# EAGLE design Sparki_Mainboard (EAGLE 6.3)

## Sheet 1 of 2
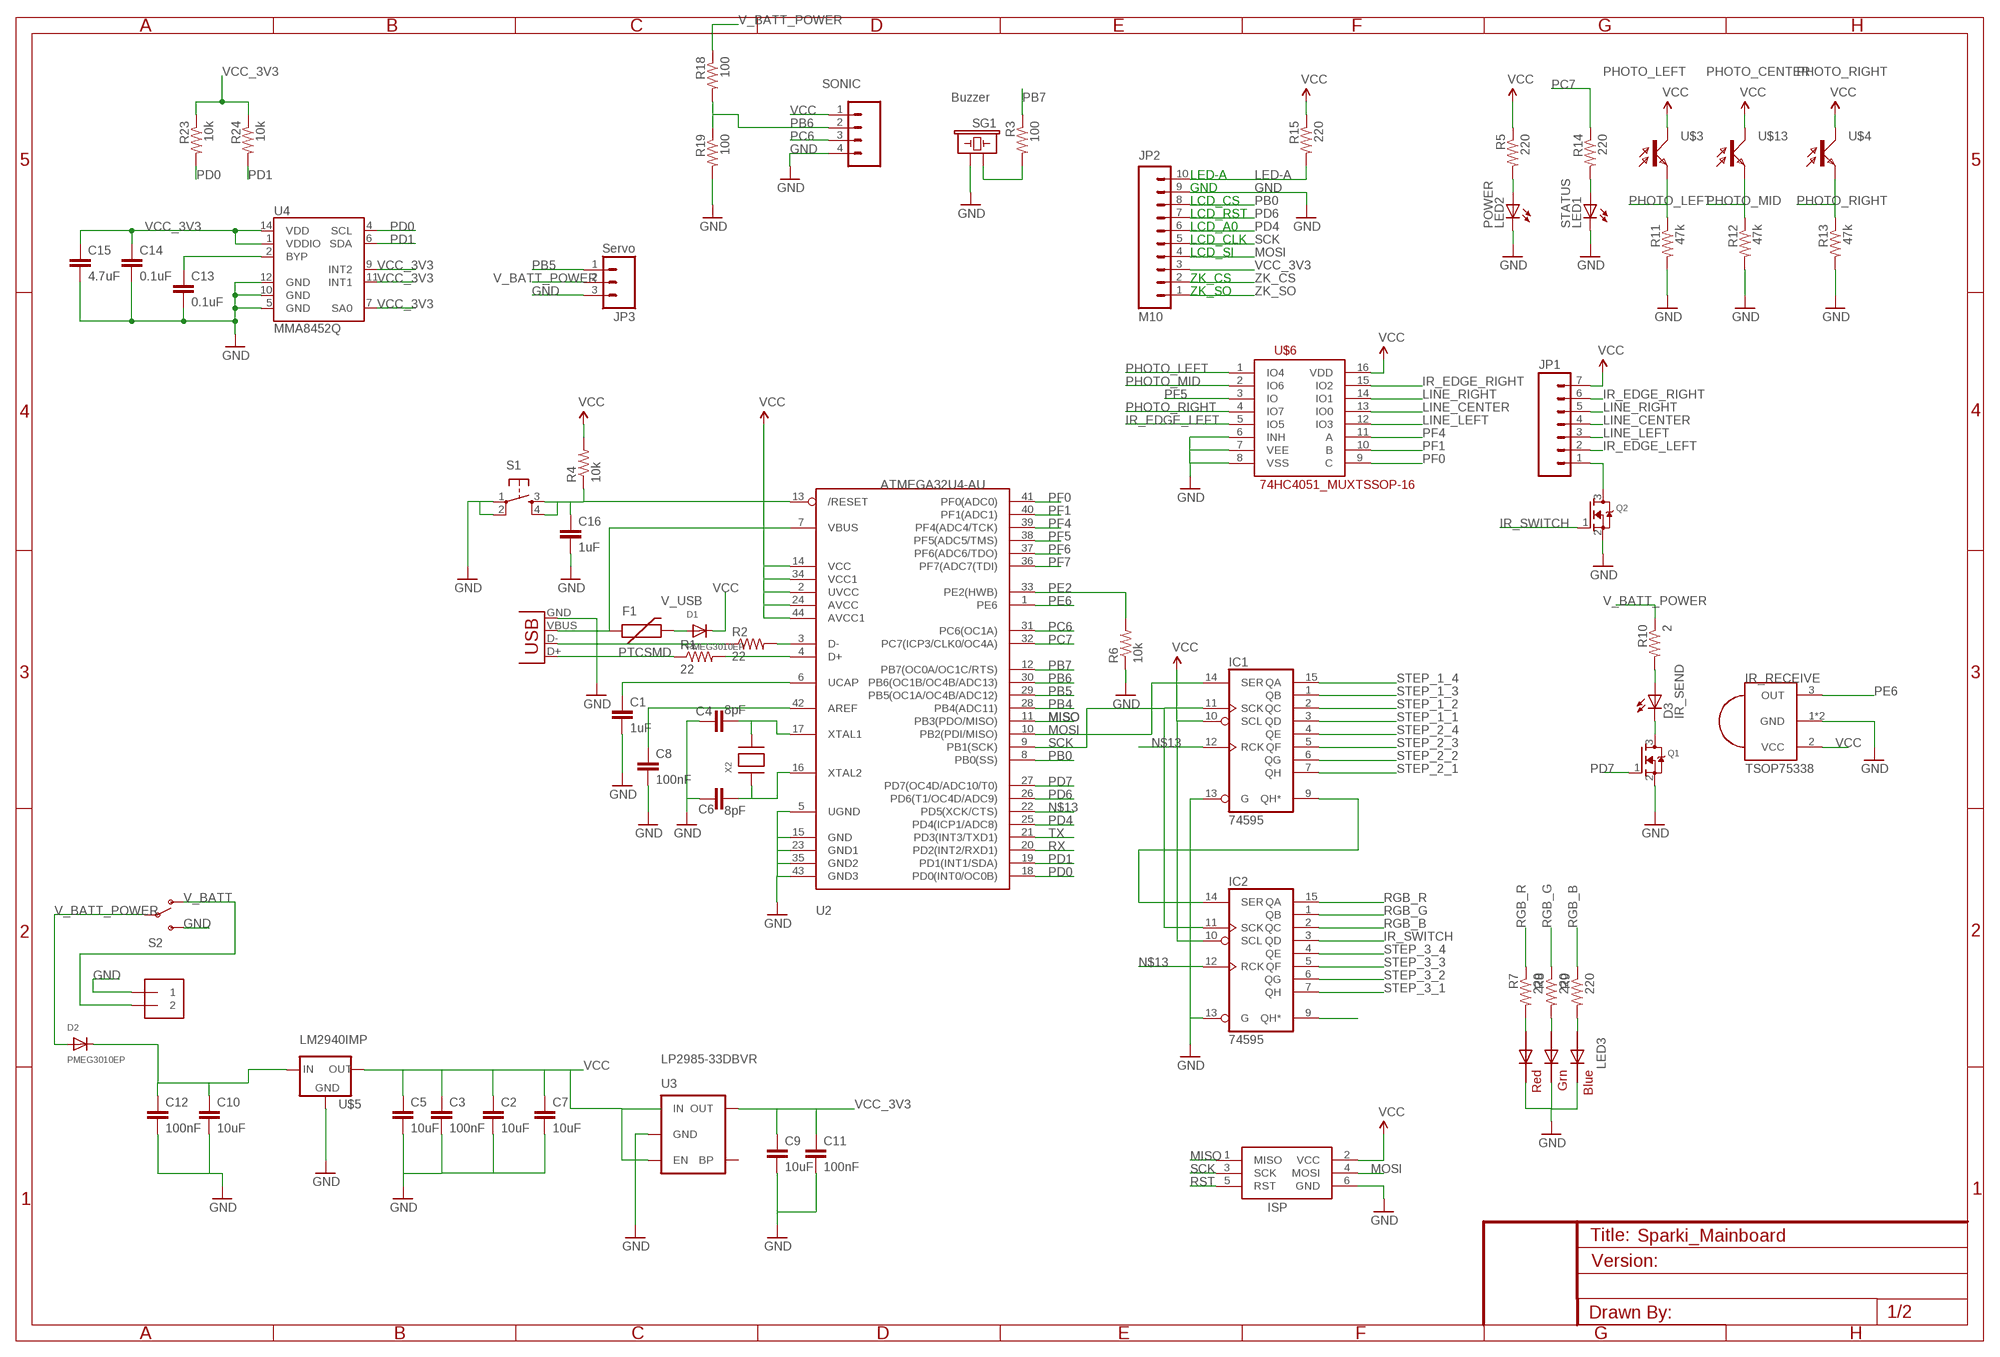
[diagram p0: schematic, sheet 1, part 1 of 2]
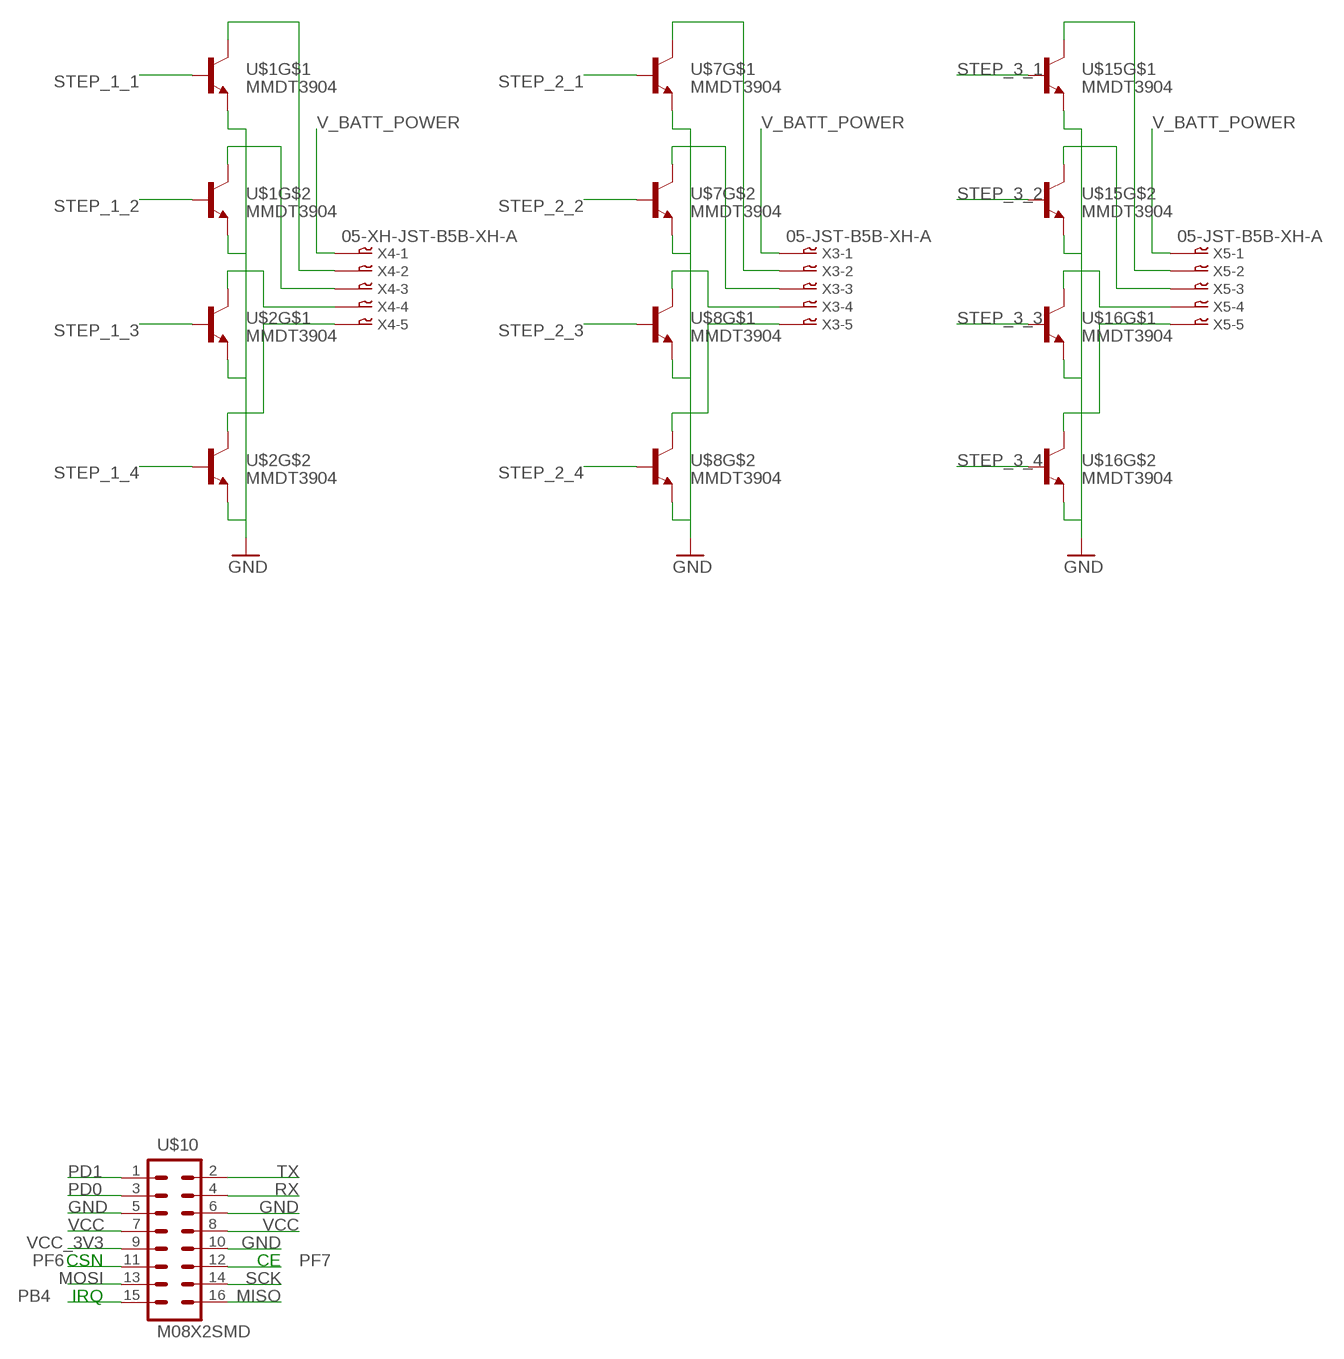
[diagram p1: schematic, sheet 1, part 2 of 2]

### Parts
C1  1uF  CAP0603-CAP  [0603-CAP]
C2  10uF  CAP0805  [0805]
C3  100nF  CAP0603-CAP  [0603-CAP]
C4  8pF  CAP0603-CAP  [0603-CAP]
C5  10uF  CAP0805  [0805]
C6  8pF  CAP0603-CAP  [0603-CAP]
C7  10uF  CAP0805  [0805]
C8  100nF  CAP0603-CAP  [0603-CAP]
C9  10uF  CAP0805  [0805]
C10  10uF  CAP0805  [0805]
C11  100nF  CAP0603-CAP  [0603-CAP]
C12  100nF  CAP0603-CAP  [0603-CAP]
C13  0.1uF  CAP0603-CAP  [0603-CAP]
C14  0.1uF  CAP0603-CAP  [0603-CAP]
C15  4.7uF  CAP0805  [0805]
C16  1uF  CAP0603-CAP  [0603-CAP]
D1  PMEG3010EP  [SOD-128]
D2  PMEG3010EP  [SOD-128]
D3  IR_SEND  LED-FKIT-1206  [FKIT-LED-1206]
F1  PTCSMD  [PTC-1206]
IC1  74595  [TSSOP16]
IC2  74595  [TSSOP16]
IR_RECEIVE  TSOP75338  [TSOP75338]
ISP  AVRISP-6  [AVRISP]
J1  1X2-3.5MM  [1X2-3.5MM]
JP1  M07  [1X07]
JP2  M10  [1X10-2.54MM-SMD]
JP3  Servo  M03PTH  [1X03]
LED1  STATUS  LEDSML0805  [SML0805]
LED2  POWER  LEDSML0805  [SML0805]
LED3  RGB LED  RGBLED5050  [RGBLED5050]
Q1  MOSFET-NREFLOW  [SOT23]
Q2  MOSFET-NREFLOW  [SOT23]
R1  22  RESISTOR0603-RES  [0603-RES]
R2  22  RESISTOR0603-RES  [0603-RES]
R3  100  RESISTOR0603-RES  [0603-RES]
R4  10k  RESISTOR0603-RES  [0603-RES]
R5  220  RESISTOR0603-RES  [0603-RES]
R6  10k  RESISTOR0603-RES  [0603-RES]
R7  220  RESISTOR0603-RES  [0603-RES]
R8  220  RESISTOR0603-RES  [0603-RES]
R9  220  RESISTOR0603-RES  [0603-RES]
R10  2  RESISTOR0603-RES  [0603-RES]
R11  47k  RESISTOR0603-RES  [0603-RES]
R12  47k  RESISTOR0603-RES  [0603-RES]
R13  47k  RESISTOR0603-RES  [0603-RES]
R14  220  RESISTOR0603-RES  [0603-RES]
R15  220  RESISTOR0603-RES  [0603-RES]
R18  100  RESISTOR0603-RES  [0603-RES]
R19  100  RESISTOR0603-RES  [0603-RES]
R23  10k  RESISTOR0603-RES  [0603-RES]
R24  10k  RESISTOR0603-RES  [0603-RES]
S1  TAC_SWITCHSMD  [TACTILE_SWITCH_SMD]
S2  SWITCH-SPDTPTH2  [SWITCHE-DPDT]
SG1  Buzzer  BUZZERSMD2  [BUZZER-CCV]
SONIC  Ultrasonic  M04SMD3  [1X04-2.54MM-SMD]
U2  ATMEGA32U4-AU  [TQFP44]
U3  LP2985-33DBVR  V_REG_LDOSMD  [SOT23-5]
U4  MMA8452Q  [QFN-16_0.5MM]
U$1  MMDT3904  [SOT363]
U$2  MMDT3904  [SOT363]
U$3  PHOTO_LEFT  PHOTOTRANSISTOR0402  [LED-0402]
U$4  PHOTO_RIGHT  PHOTOTRANSISTOR0402  [LED-0402]
U$5  LM2940IMP  V_REG_MIC2920  [SOT223]
U$6  74HC4051_MUXTSSOP-16  [TSSOP-16]
U$7  MMDT3904  [SOT363]
U$8  MMDT3904  [SOT363]
U$10  M08X2SMD  [2X08-2.54MM-SMD]
U$13  PHOTO_CENTER  PHOTOTRANSISTOR0402  [LED-0402]
U$15  MMDT3904  [SOT363]
U$16  MMDT3904  [SOT363]
X1  USBSMD  [USB-MINIB]
X2  XTALNX5032  [NX5032]
X3  05-JST-B5B-XH-A  [B5B-XH]
X4  05-XH-JST-B5B-XH-A  [B5B-XH]
X5  05-JST-B5B-XH-A  [B5B-XH]

### Nets
ACCEL_BYP: C13.1 U4.2(BYP)
D+: R1.2 U2.4(D+)
D-: R2.2 U2.3(D-)
GND: C1.2 C2.2 C3.2 C4.2 C5.2 C6.2 C7.2 C8.2 C9.2 C10.2 C11.2 C12.2 C13.2 C14.2 C15.2 C16.2 IC1.13(G) IC2.13(G) IR_RECEIVE.1(GND) IR_RECEIVE.4(GND) ISP.6(GND) J1.1 JP2.9 JP3.3 LED1.C LED2.C LED3.4(BLUE_C) LED3.5(RED_C) LED3.6(GREEN_C) Q1.2(S) Q2.2(S) R6.1 R11.2 R12.2 R13.2 R19.2 S1.1 S1.2 S2.3(S) SG1.- SONIC.4 U2.5(UGND) U2.15(GND) U2.23(GND1) U2.35(GND2) U2.43(GND3) U3.2(GND) U4.5(GND) U4.10(GND) U4.12(GND) U$1.1(E) U$1.4(E) U$2.1(E) U$2.4(E) U$5.2(GND) U$6.6(INH) U$6.7(VEE) U$6.8(VSS) U$7.1(E) U$7.4(E) U$8.1(E) U$8.4(E) U$10.5 U$10.6 U$10.10 U$15.1(E) U$15.4(E) U$16.1(E) U$16.4(E) X1.GND
IR_EDGE_LEFT: JP1.2 U$6.5(IO5)
IR_EDGE_RIGHT: JP1.6 U$6.15(IO2)
IR_SWITCH: IC2.3(QD) Q2.1(G)
IRSEND: D3.A R10.2
LED-A: JP2.10 R15.2
LINE_CENTER: JP1.4 U$6.13(IO0)
LINE_LEFT: JP1.3 U$6.12(IO3)
LINE_RIGHT: JP1.5 U$6.14(IO1)
MISO: ISP.1(MISO) U2.11(PB3(PDO/MISO)) U$10.16
MOSI: IC1.14(SER) ISP.4(MOSI) JP2.4 U2.10(PB2(PDI/MISO)) U$10.13
N$1: IC2.9(QH*)
N$2: LED2.A R5.2
N$3: U$7.3(C) X3.P$2
N$4: R2.1 X1.D-
N$5: R1.1 X1.D+
N$6: LED3.2(RED_A) R7.2
N$7: U$2.6(C) X4.P$5
N$8: LED3.1(GREEN_A) R8.2
N$9: LED3.3(BLUE_A) R9.2
N$10: U$2.3(C) X4.P$4
N$11: U$16.6(C) X5.P$5
N$12: U$1.6(C) X4.P$3
N$13: IC1.12(RCK) IC2.12(RCK) U2.22(PD5(XCK/CTS))
N$14: U$16.3(C) X5.P$4
N$15: U$15.6(C) X5.P$3
N$16: U$15.3(C) X5.P$2
N$17: IC1.9(QH*) IC2.14(SER)
N$18: D3.C Q1.3(D)
N$19: LED1.A R14.2
N$21: U$1.3(C) X4.P$2
N$29: C8.1 U2.42(AREF)
N$30: U$8.6(C) X3.P$5
N$31: U$8.3(C) X3.P$4
N$32: U$7.6(C) X3.P$3
N$41: JP1.1 Q2.3(D)
N$42: R3.2 SG1.+
PB0: JP2.8 U2.8(PB0(SS))
PB4: U2.28(PB4(ADC11)) U$10.15
PB5: JP3.1 U2.29(PB5(OC1A/OC4B/ADC12))
PB6: R18.2 R19.1 SONIC.2 U2.30(PB6(OC1B/OC4B/ADC13))
PB7: R3.1 U2.12(PB7(OC0A/OC1C/RTS))
PC6: SONIC.3 U2.31(PC6(OC1A))
PC7: R14.1 U2.32(PC7(ICP3/CLK0/OC4A))
PD0: R23.2 U2.18(PD0(INT0/OC0B)) U4.4(SCL) U$10.3
PD1: R24.2 U2.19(PD1(INT1/SDA)) U4.6(SDA) U$10.1
PD4: JP2.6 U2.25(PD4(ICP1/ADC8))
PD6: JP2.7 U2.26(PD6(T1/OC4D/ADC9))
PD7: Q1.1(G) U2.27(PD7(OC4D/ADC10/T0))
PE2: R6.2 U2.33(PE2(HWB))
PE6: IR_RECEIVE.3(OUT) U2.1(PE6)
PF0: U2.41(PF0(ADC0)) U$6.9(C)
PF1: U2.40(PF1(ADC1)) U$6.10(B)
PF4: U2.39(PF4(ADC4/TCK)) U$6.11(A)
PF5: U2.38(PF5(ADC5/TMS)) U$6.3(IO)
PF6: U2.37(PF6(ADC6/TDO)) U$10.11
PF7: U2.36(PF7(ADC7(TDI)) U$10.12
PHOTO_LEFT: R11.1 U$3.2(E) U$6.1(IO4)
PHOTO_MID: R12.1 U$6.2(IO6) U$13.2(E)
PHOTO_RIGHT: R13.1 U$4.2(E) U$6.4(IO7)
RGB_B: IC2.2(QC) R9.1
RGB_G: IC2.1(QB) R8.1
RGB_R: IC2.15(QA) R7.1
RST: C16.1 ISP.5(RST) R4.1 S1.3 S1.4 U2.13(/RESET)
RX: U2.20(PD2(INT2/RXD1)) U$10.4
SCK: IC1.11(SCK) IC2.11(SCK) ISP.3(SCK) JP2.5 U2.9(PB1(SCK)) U$10.14
STEP_1_1: IC1.3(QD) U$1.5(B)
STEP_1_2: IC1.2(QC) U$1.2(B)
STEP_1_3: IC1.1(QB) U$2.5(B)
STEP_1_4: IC1.15(QA) U$2.2(B)
STEP_2_1: IC1.7(QH) U$7.5(B)
STEP_2_2: IC1.6(QG) U$7.2(B)
STEP_2_3: IC1.5(QF) U$8.5(B)
STEP_2_4: IC1.4(QE) U$8.2(B)
STEP_3_1: IC2.7(QH) U$15.5(B)
STEP_3_2: IC2.6(QG) U$15.2(B)
STEP_3_3: IC2.5(QF) U$16.5(B)
STEP_3_4: IC2.4(QE) U$16.2(B)
TX: U2.21(PD3(INT3/TXD1)) U$10.2
UCAP: C1.1 U2.6(UCAP)
V_BATT: J1.2 S2.1(O)
V_BATT_POWER: D2.P$2(A) JP3.2 R10.1 R18.1 S2.2(P) X3.P$1 X4.P$1 X5.P$1
V_USB: D1.P$2(A) F1.2
VBUS: F1.1 U2.7(VBUS) X1.VBUS
VCC: C2.1 C3.1 C5.1 C7.1 D1.P$1(C) IC1.10(SCL) IC2.10(SCL) IR_RECEIVE.2(VCC) ISP.2(VCC) JP1.7 R4.2 R5.1 R15.1 SONIC.1 U2.2(UVCC) U2.14(VCC) U2.24(AVCC) U2.34(VCC1) U2.44(AVCC1) U3.1(IN) U3.3(EN) U$3.1(C) U$4.1(C) U$5.3(OUT) U$6.16(VDD) U$10.7 U$10.8 U$13.1(C)
VCC_3V3: C9.1 C11.1 C14.1 C15.1 JP2.3 R23.1 R24.1 U3.5(OUT) U4.1(VDDIO) U4.7(SA0) U4.9(INT2) U4.11(INT1) U4.14(VDD) U$10.9
VREGS_IN: C10.1 C12.1 D2.P$1(C) U$5.1(IN)
XTAL1: C4.1 U2.17(XTAL1) X2.P$2
XTAL2: C6.1 U2.16(XTAL2) X2.P$1
ZK_CS: JP2.2
ZK_SO: JP2.1
Unconnected: U3.4(BP)

### Notes on the sheet
- LED-A
- GND
- LCD_CS
- LCD_RST
- LCD_A0
- LCD_CLK
- LCD_SI
- ZK_CS
- ZK_SO
- CSN | CE
- IRQ

## Sheet 2 of 2
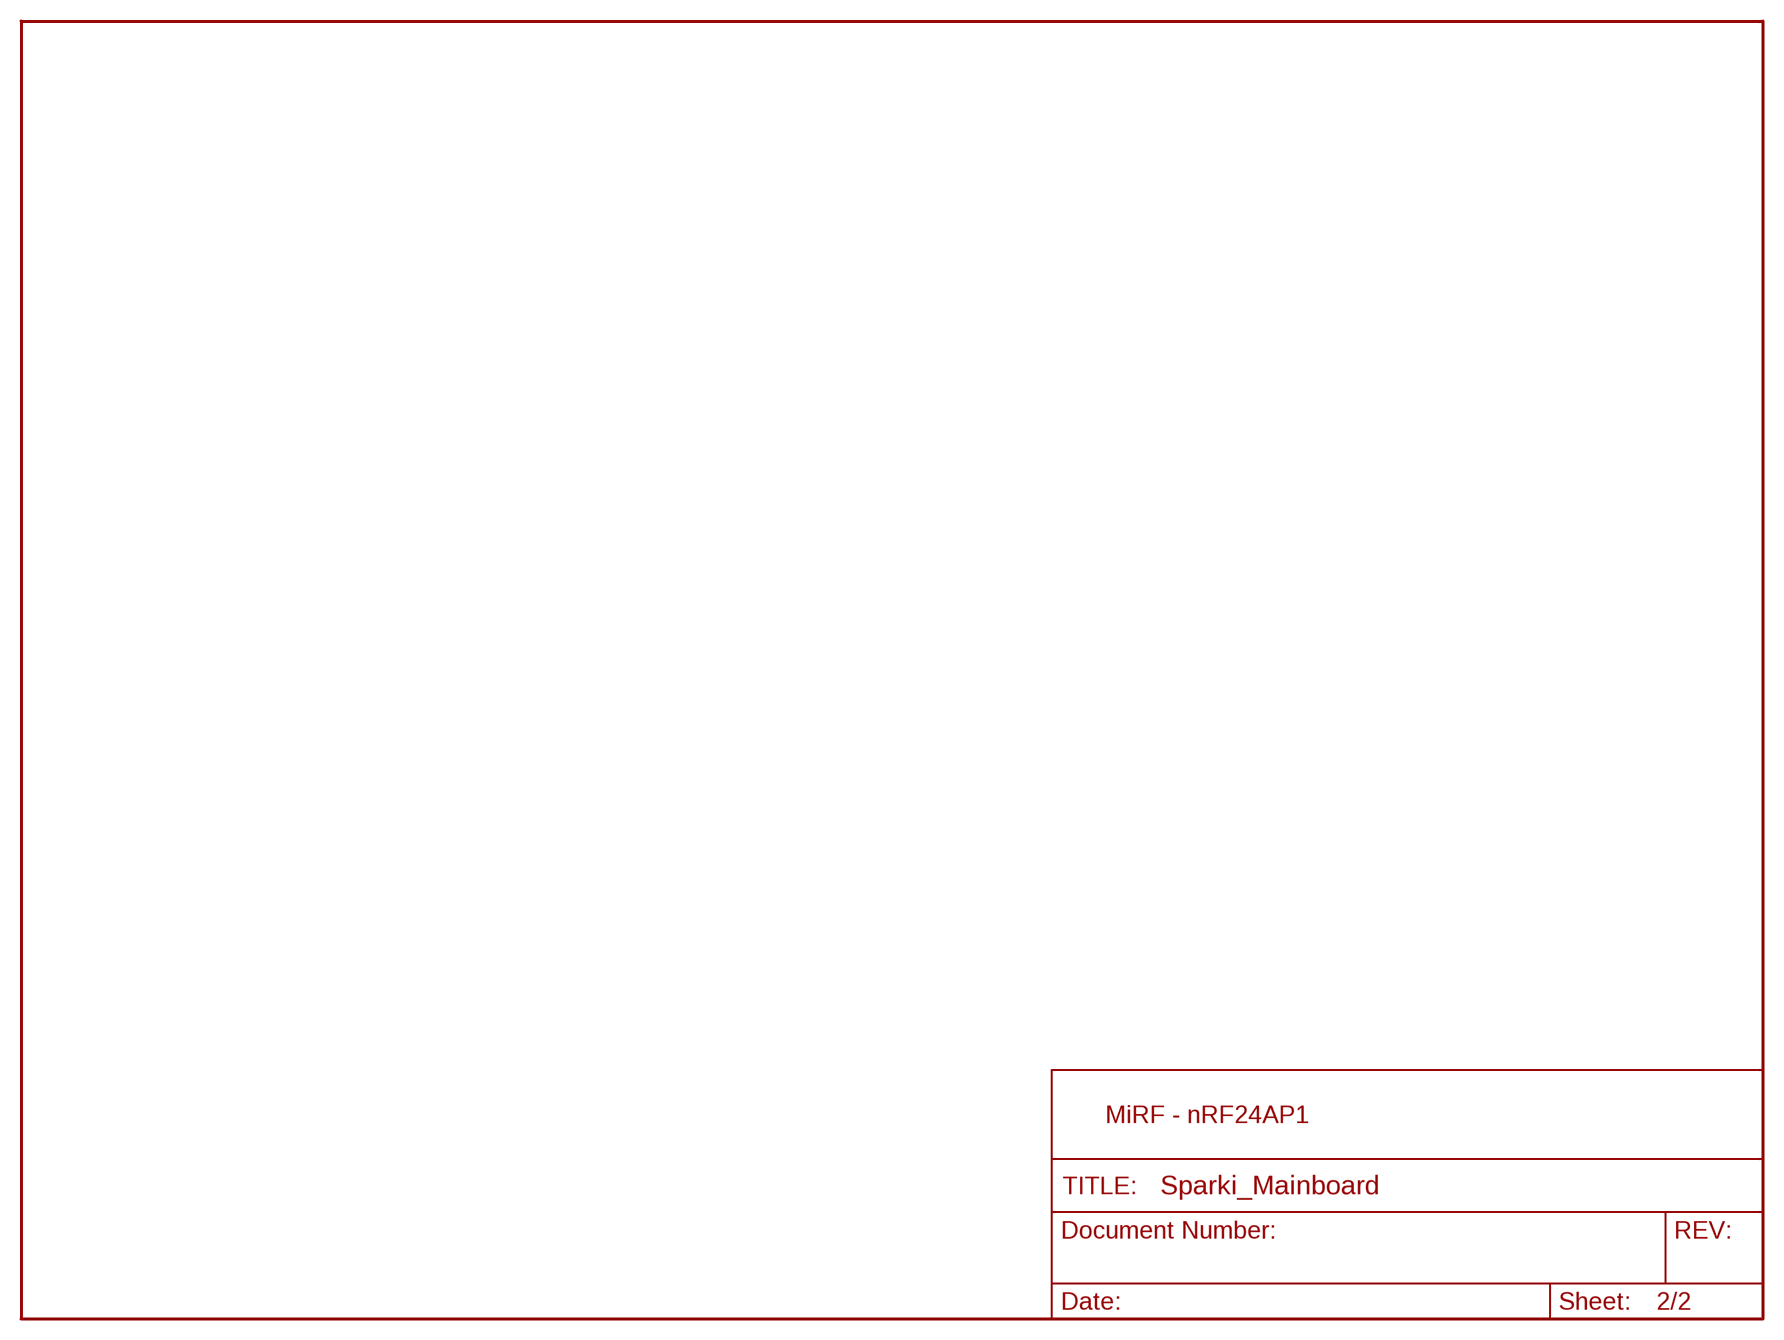
[diagram p2: schematic, sheet 2]

### Notes on the sheet
- MiRF - nRF24AP1

## Power pins joined to a net without a drawn wire
GND: IC1.8(GND) IC2.8(GND)
VCC: IC1.16(VCC) IC2.16(VCC)

## Library data of the parts
C1-C16 = SparkFun-Passives:CAP: Capacitor Standard 0603 ceramic capacitor, and 0.1" leaded capacitor.
D1 D2 = arcbotics:PMEG3010EP
D3 = arcbotics:LED: IR26-51C/L110/TR8 1A burstable IR Led, side-mounted in 1206 package
F1 = SparkFun:PTC: Resettable Fuse PTC Resettable Fuse. Spark Fun Electronics SKU : COM-08357
IC1 IC2 = arcbotics:74*595: 8-bit SHIFT REGISTER, output latch
IR_RECEIVE = arcbotics:TSOP75338
ISP = adafruit:AVRISP: AVR ISP HEADER Standard 6 pin header for AVR programming
J1 = adafruit:1X2: 3.5mm Terminal block http://www.ladyada.net/library/pcb/eaglelibrary.html
JP1 = SparkFun-Connectors:M07: Header 7 Standard 7-pin 0.1" header. Use with straight break away headers (SKU : PRT-00116), right angle break away headers (PRT-00553), swiss pins (PRT-00743), machine pins (PRT-00117), and female headers (PRT-00115). NOTES ON THE VARIANTS LOCK and LOCK_LONGPADS... This footprint was designed to help hold the alignment of a through-hole component (i.e. 7-pin header) while soldering it into place. You may notice that each hole has been shifted either up or down by 0.005 of an inch from it's more standard position (which is usually a perfectly straight line). This slight alteration caused the pins (the squares in the middle) to touch the edges of the holes. Because they are alternating, it causes a "brace" to hold the header in place. 0.005 has proven to be the perfect amount of "off-center" position when using our standard breakaway headers. Although looks a little odd when you look at the bare footprint, once you have a header in there, the alteration is very hard to notice. Also, if you push a header all the way into place, it is covered up entirely on the bottom side. This idea of altering the position of holes to aid alignment will be further integrated into the Sparkfun Library for other footprints. It can help hold any component with 3 or more connection pins.
JP2 = arcbotics:M10: Header 10 Standard 10-pin 0.1" header. Use with straight break away headers (SKU : PRT-00116), right angle break away headers (PRT-00553), swiss pins (PRT-00743), machine pins (PRT-00117), and female headers (PRT-00115).
JP3 = SparkFun-Connectors:M03: Header 3 Standard 3-pin 0.1" header. Use with straight break away headers (SKU : PRT-00116), right angle break away headers (PRT-00553), swiss pins (PRT-00743), machine pins (PRT-00117), and female headers (PRT-00115). Molex polarized connector foot print use with SKU : PRT-08232 with associated crimp pins and housings.
LED1 LED2 = led:LED: LED OSRAM: - CHIPLED LG R971, LG N971, LY N971, LG Q971, LY Q971, LO R971, LY R971 LH N974, LH R974 LS Q976, LO Q976, LY Q976 LO Q996 - Hyper CHIPLED LW Q18S LB Q993, LB Q99A, LB R99A - SideLED LS A670, LO A670, LY A670, LG A670, LP A670 LB A673, LV A673, LT A673, LW A673 LH A674 LY A675 LS A676, LA A676, LO A676, LY A676, LW A676 LS A679, LY A679, LG A679 - Hyper Micro SIDELED® LS Y876, LA Y876, LO Y876, LY Y876 LT Y87S - SmartLED LW L88C, LW L88S LB L89C, LB L89S, LG L890 LS L89K, LO L89K, LY L89K LS L896, LA L896, LO L896, LY L896 - TOPLED LS T670, LO T670, LY T670, LG T670, LP T670 LSG T670, LSP T670, LSY T670, LOP T670, LYG T670 LG T671, LOG T671, LSG T671 LB T673, LV T673, LT T673, LW T673 LH T674 LS T676, LA T676, LO T676, LY T676, LB T676, LH T676, LSB T676, LW T676 LB T67C, LV T67C, LT T67C, LS T67K, LO T67K, LY T67K, LW E67C LS E67B, LA E67B, LO E67B, LY E67B, LB E67C, LV E67C, LT E67C LW T67C LS T679, LY T679, LG T679 LS T770, LO T770, LY T770, LG T770, LP T770 LB T773, LV T773, LT T773, LW T773 LH T774 LS E675, LA E675, LY E675, LS T675 LS T776, LA T776, LO T776, LY T776, LB T776 LHGB T686 LT T68C, LB T68C - Hyper Mini TOPLED® LB M676 - Mini TOPLED Santana® LG M470 LS M47K, LO M47K, LY M47K Source: http://www.osram.convergy.de LUXEON: - LUMILED® LXK2-PW12-R00, LXK2-PW12-S00, LXK2-PW14-U00, LXK2-PW14-V00 LXK2-PM12-R00, LXK2-PM12-S00, LXK2-PM14-U00 LXK2-PE12-Q00, LXK2-PE12-R00, LXK2-PE12-S00, LXK2-PE14-T00, LXK2-PE14-U00 LXK2-PB12-K00, LXK2-PB12-L00, LXK2-PB12-M00, LXK2-PB14-N00, LXK2-PB14-P00, LXK2-PB14-Q00 LXK2-PR12-L00, LXK2-PR12-M00, LXK2-PR14-Q00, LXK2-PR14-R00 LXK2-PD12-Q00, LXK2-PD12-R00, LXK2-PD12-S00 LXK2-PH12-R00, LXK2-PH12-S00 LXK2-PL12-P00, LXK2-PL12-Q00, LXK2-PL12-R00 Source: www.luxeon.com KINGBRIGHT: KA-3528ASYC Source: www.kingbright.com
LED3 = adafruit:RGBLED: For 5050 RGB LEDs, the order of the LEDs may vary from one manufacturer to another!
Q1 Q2 = adafruit:MOSFET-N: N-Channel Mosfet 2N7002E - 60V 260mA SOT23 [Digikey: 2N7002ET1GOSTR-ND] - REEL BSH103 - 30V 850mA SOT23 [Digikey: 568-5013-1-ND]
R1-R15 R18 R19 R23 R24 = SparkFun-Passives:RESISTOR: Resistor Basic schematic elements and footprints for 0603, 1206, and PTH resistors.
S1 = SparkFun-Electromechanical:TAC_SWITCH: Momentary Switch Button commonly used for reset or general input. Spark Fun Electronics SKU : COM-00097 SMT- SWCH-08247; PROD_ID: SWCH-08247
S2 = SparkFun-Electromechanical:SWITCH-SPDT: SPDT Switch Simple slide switch, Spark Fun Electronics SKU : COM-00102 DPDT SMT slide switch, AYZ0202, SWCH-08179
SG1 = arcbotics:BUZZER: Buzzer 12mm Spark Fun Electronics SKU : Comp-Buzzer
SONIC = arcbotics:M04: Header 4 Standard 4-pin 0.1" header. Use with straight break away headers (SKU : PRT-00116), right angle break away headers (PRT-00553), swiss pins (PRT-00743), machine pins (PRT-00117), and female headers (PRT-00115). Molex polarized connector foot print use with SKU : PRT-08231 with associated crimp pins and housings. 1MM SMD Version SKU: PRT-10208
U2 = adafruit:ATMEGA32U4: http://www.ladyada.net/library/eagle
U3 = SparkFun:V_REG_LDO: Voltage Regulator LDO Standard 150mA LDO voltage regulator in SOT-23 layout. Micrel part MIC5205. BP (by-pass) pin is used to lower output noise with 470pF cap.
U4 = SparkFun-Sensors:MMA8452Q: MMA8452Q 3-Axis, 12/8-bit Digital Accelerometer Supply Voltage: 1.6-3.6V Range: +/- 2g, 4g, 8g Interface: I2C, 12-bit and 8-bit ODR: 1.56 Hz - 800 Hz Package: QFN-16 http://cache.freescale.com/files/sensors/doc/data_sheet/MMA8452Q.pdf
U$1 U$2 U$7 U$8 U$15 U$16 = SparkFun-DiscreteSemi:MMDT3904: Dual NPN transistor
U$3 U$4 U$13 = arcbotics:PHOTOTRANSISTOR: 0603 - PT19-21C/L41/TR8 - more geared towards infrared 1206 - EL-PT11 - spread between infrared and visible
U$5 = SparkFun-PowerIC:V_REG_MIC2920: MIC2920A (http://www.micrel.com/_PDF/mic2920.pdf) - 400mA output LDO Regulator
U$6 = arcbotics:74HC4051_MUX
U$10 = arcbotics:M08X2: .1" headers, two rows of 8 each
X1 = SparkFun-Connectors:USB: USB Connectors USB-B-PTH is fully proven SKU : PRT-00139 USB-miniB is fully proven SKU : PRT-00587 USB-A-PCB is untested. USB-A-H is throughly reviewed, but untested. Spark Fun Electronics SKU : PRT-00437 USB-B-SMT is throughly reviewed, but untested. Needs silkscreen touching up. USB-A-S has not been used/tested USB-MB-H has not been used/tested
X2 = adafruit:XTAL: Low cost SMT crystals, no capacitors included http://www.ladyada.net/library/eagle
X3 X5 = arcbotics:05-JST: JST CONNECTOR
X4 = arcbotics:05-XH-JST: JST CONNECTOR

## Board
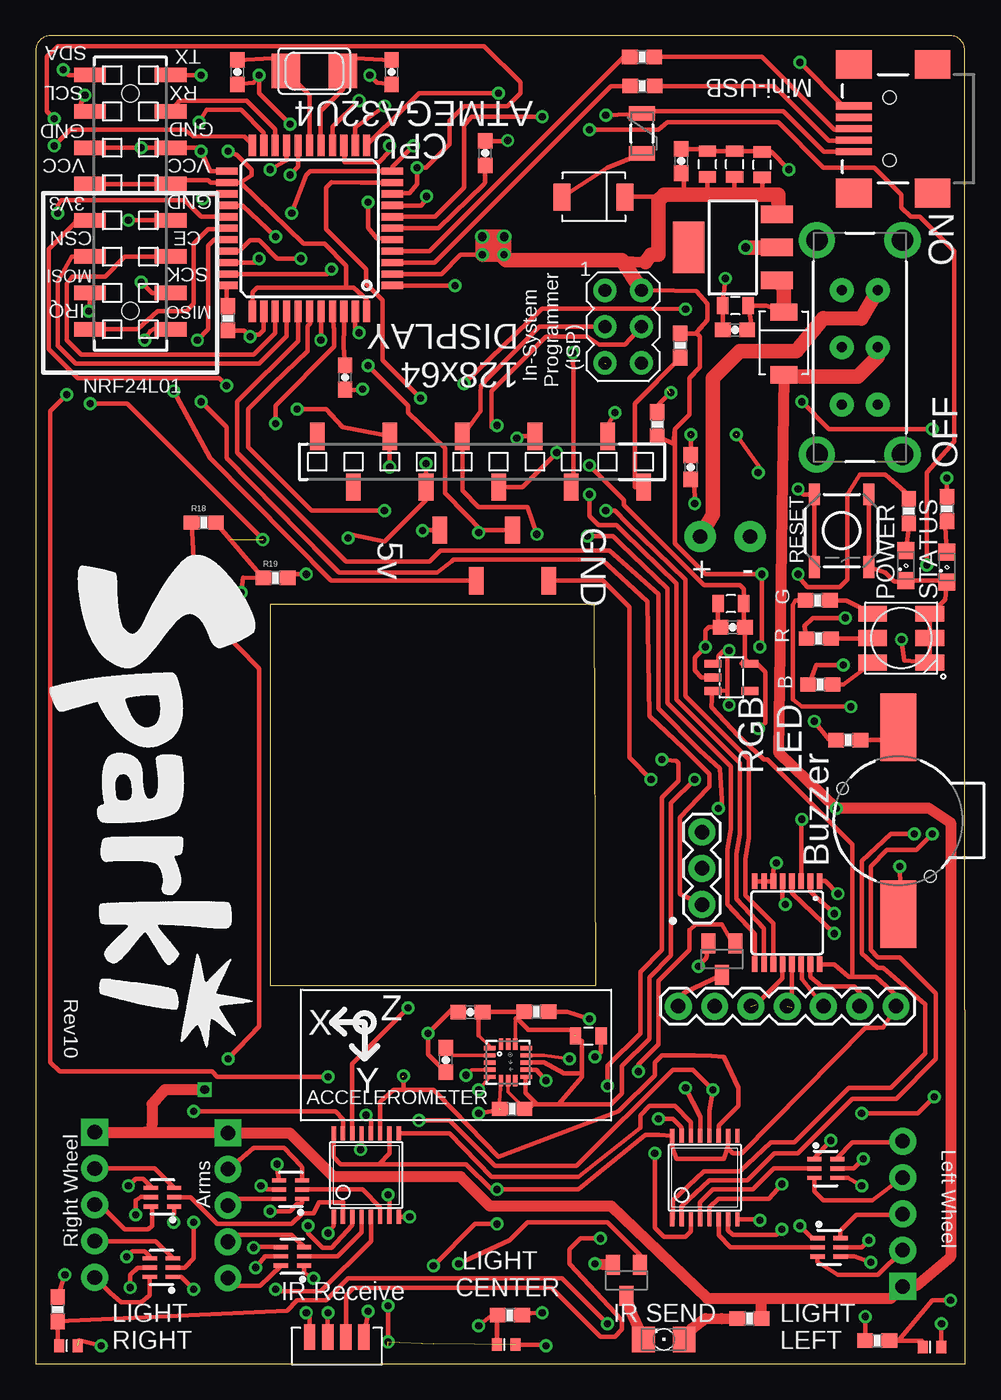
[diagram p3: board, top side]
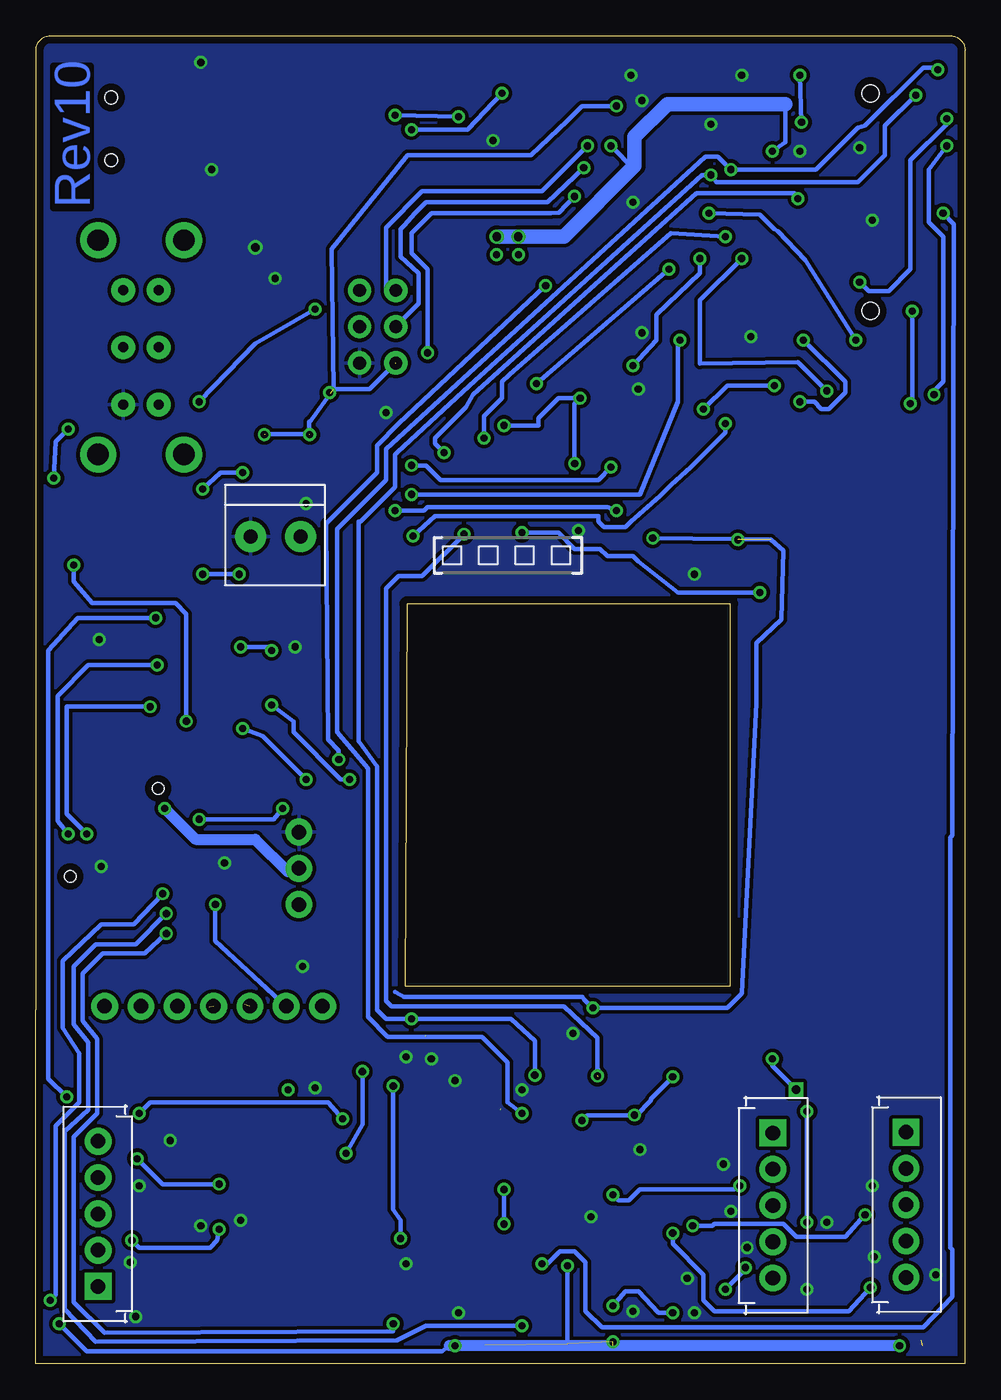
[diagram p4: board, bottom side, seen from below]

Size 65.04 x 92.93 mm. Coordinates in mm from the lower left corner, seen from the top.
Outline: 0.01,91.92 0.01,0 65.04,0 65.04,24.76
Outline: 65.01,24.76 65.01,91.92 arc89 64.02,92.93
Outline: 64.02,92.91 1,92.91 arc90 0,91.92
Outline: 16.42,53.16 39.05,53.16 39.18,26.44 16.42,26.44 16.42,53.16
Copper layers (1+16): Top 0.0178mm / dielectric 59mil / Bottom 0.0178mm
Design rules "China *": minimum track width 10mil, minimum drill 14mil, track to track 10mil, track to pad 10mil, pad to pad 10mil, via to via 10mil, smd to smd 6mil, copper to edge 20mil, drill to drill 16mil, minimum pad ring 8mil, minimum via ring 8mil, stop-mask expansion 3mil, vias tented up to drill 25mil, thermal gap 10mil

### Footprints (pad centres in the part's own frame; a part is rotated, then mirrored left to right if it is on the bottom)
0603-CAP = smd 1.1 x 1: 1 -0.85,0; 2 0.85,0
0805 = smd 0.8 x 1.2: 1 -0.9,0; 2 0.9,0
SOD-128 = smd 1.2 x 1.9: P$1 -2.223,0.016; P$2 2.179,0.016
FKIT-LED-1206 = smd 1.6 x 1.803: A -1.422,0; C 1.422,0
PTC-1206 = smd 1 x 1.8: 1 -1.4,0; 2 1.4,0
TSSOP16 = smd 0.305 x 0.991: 1 -2.275,-2.918; 2 -1.625,-2.918; 3 -0.975,-2.918; 4 -0.325,-2.918; 5 0.325,-2.918; 6 0.975,-2.918; 7 1.625,-2.918; 8 2.275,-2.918; 9 2.275,2.918; 10 1.625,2.918; 11 0.975,2.918; 12 0.325,2.918; 13 -0.325,2.918; 14 -0.975,2.918; 15 -1.625,2.918; 16 -2.275,2.918
TSOP75338 = smd 0.8 x 1.8: 1 -2.54,0; 2 -1.27,0; 3 0,0; 4 1.27,0
AVRISP = drill 0.9 pad 1.626: 1 -1.27,2.54; 2 1.27,2.54; 3 -1.27,0; 4 1.27,0; 5 -1.27,-2.54; 6 1.27,-2.54
1X2-3.5MM = drill 1 pad 2.184: 1 1.8,0; 2 -1.7,0
1X07 = drill 1.016 pad 1.88: 1 0,0; 2 2.54,0; 3 5.08,0; 4 7.62,0; 5 10.16,0; 6 12.7,0; 7 15.24,0
1X10-2.54MM-SMD = smd 1.02 x 1.9: 1 0,1.778; 2 2.54,-1.778; 3 5.08,1.778; 4 7.62,-1.778; 5 10.16,1.778; 6 12.7,-1.778; 7 15.24,1.778; 8 17.78,-1.778; 9 20.32,1.778; 10 22.86,-1.778
1X03 = drill 1.016 pad 1.88: 1 0,0; 2 2.54,0; 3 5.08,0
SML0805 = smd 1.2 x 1.2: A 1.05,0; C -1.05,0
RGBLED5050 = smd 2 x 1.1: 1 -2,1.7; 2 -2,0; 3 -2,-1.7; 4 2,-1.7; 5 2,0; 6 2,1.7
SOT23 = smd 1 x 1.4: 1 -0.95,-1.1; 2 0.95,-1.1; 3 0,1.1
0603-RES = smd 1.1 x 1: 1 -0.85,0; 2 0.85,0
TACTILE_SWITCH_SMD = smd 1.524 x 0.762: 1 -2.54,1.905; 2 2.54,1.905; 3 -2.54,-1.905; 4 2.54,-1.905
SWITCHE-DPDT = drill 0.7 pad 1.676: 1 -4,1.25; 2 0,1.25; 3 4,1.25; 4 -4,-1.25; 5 0,-1.25; 6 4,-1.25 | drill 1.5 pad 2.54: P$1 -7.5,3; P$2 -7.5,-3; P$3 7.5,3; P$4 7.5,-3
BUZZER-CCV = smd 4.724 x 2.5: + 6.54,0; - -6.54,0 | hole 0.8: -3.9,-2.25; 2.25,3.9
1X04-2.54MM-SMD = smd 1.02 x 1.9: 1 7.62,-1.778; 2 5.08,1.778; 3 2.54,-1.778; 4 0,1.778
TQFP44 = smd 1.5 x 0.5: 1 -5.8,4; 2 -5.8,3.2; 3 -5.8,2.4; 4 -5.8,1.6; 5 -5.8,0.8; 6 -5.8,0; 7 -5.8,-0.8; 8 -5.8,-1.6; 9 -5.8,-2.4; 10 -5.8,-3.2; 11 -5.8,-4; 23 5.8,-4; 24 5.8,-3.2; 25 5.8,-2.4; 26 5.8,-1.6; 27 5.8,-0.8; 28 5.8,0; 29 5.8,0.8; 30 5.8,1.6; 31 5.8,2.4; 32 5.8,3.2; 33 5.8,4 | smd 0.5 x 1.5: 12 -4,-5.8; 13 -3.2,-5.8; 14 -2.4,-5.8; 15 -1.6,-5.8; 16 -0.8,-5.8; 17 0,-5.8; 18 0.8,-5.8; 19 1.6,-5.8; 20 2.4,-5.8; 21 3.2,-5.8; 22 4,-5.8; 34 4,5.8; 35 3.2,5.8; 36 2.4,5.8; 37 1.6,5.8; 38 0.8,5.8; 39 0,5.8; 40 -0.8,5.8; 41 -1.6,5.8; 42 -2.4,5.8; 43 -3.2,5.8; 44 -4,5.8
SOT23-5 = smd 0.55 x 1.2: 1 -0.95,-1.3; 2 0,-1.3; 3 0.95,-1.3; 4 0.95,1.3; 5 -0.95,1.3
QFN-16_0.5MM = smd 0.8 x 0.3: 1 -1.275,1; 2 -1.275,0.5; 3 -1.275,0; 4 -1.275,-0.5; 5 -1.275,-1; 9 1.275,-1; 10 1.275,-0.5; 11 1.275,0; 12 1.275,0.5; 13 1.275,1 | smd 0.3 x 0.8: 6 -0.5,-1.275; 7 0,-1.275; 8 0.5,-1.275; 14 0.5,1.275; 15 0,1.275; 16 -0.5,1.275
SOT363 = smd 0.3 x 0.99: 1 -0.65,-0.8; 2 0,-0.8; 3 0.65,-0.8; 4 0.65,0.81; 5 0,0.81; 6 -0.65,0.81
LED-0402 = smd 0.7 x 0.9: 1 -0.65,0; 2 0.65,0
SOT223 = smd 1.219 x 2.235: 1 -2.311,-3.099; 2 0,-3.099; 3 2.311,-3.099 | smd 3.6 x 2.2: 4 0,3.099
TSSOP-16 = smd 0.4 x 1.1: 1 -2.275,-2.9; 2 -1.625,-2.9; 3 -0.975,-2.9; 4 -0.325,-2.9; 5 0.325,-2.9; 6 0.975,-2.9; 7 1.625,-2.9; 8 2.275,-2.9; 9 2.275,2.9; 10 1.625,2.9; 11 0.975,2.9; 12 0.325,2.9; 13 -0.325,2.9; 14 -0.975,2.9; 15 -1.625,2.9; 16 -2.275,2.9
2X08-2.54MM-SMD = smd 1.016 x 2.223: 1 0,-1.556; 2 0,4.096; 3 2.54,-1.556; 4 2.54,4.096; 5 5.08,-1.556; 6 5.08,4.096; 7 7.62,-1.556; 8 7.62,4.096; 9 10.16,-1.556; 10 10.16,4.096; 11 12.7,-1.556; 12 12.7,4.096; 13 15.24,-1.556; 14 15.24,4.096; 15 17.78,-1.556; 16 17.78,4.096 | hole 1.2: 1.27,1.27; 16.51,1.27
USB-MINIB = smd 2.5 x 0.5: D+ 2.5,0; D- 2.5,0.8; GND 2.5,-1.6; ID 2.5,-0.8; VBUS 2.5,1.6 | smd 2.5 x 2: MTN1 -3,4.5; MTN2 2.5,4.5; MTN3 -3,-4.5; MTN4 2.5,-4.5 | hole 0.9: 0,2.2; 0,-2.2
NX5032 = smd 2 x 2.4: P$1 2,0; P$2 -2,0
B5B-XH = drill 1.016 pad 1.88 square: P$1 -5.08,0 | drill 1.016 pad 1.88: P$2 -2.54,0; P$3 0,0; P$4 2.54,0; P$5 5.08,0

### Placement (x,y rotation side)
C1  31.46,84.71 90 top
C2  48.91,83.95 90 top
C3  45.17,84.15 90 top
C4  14.11,90.37 270 top
C5  50.84,83.9 90 top
C6  24.9,90.37 270 top
C7  47,83.95 90 top
C8  21.65,69.01 270 top
C9  48.65,53.19 180 top
C10  48.96,74.04 180 top
C11  48.78,51.54 180 top
C12  48.93,72.34 180 top
C13  28.69,21.26 270 top
C14  30.42,24.61 180 top
C15  38.67,22.94 0 top
C16  45.83,62.74 270 top
D1  39,81.64 180 top
D2  52.34,71.37 270 top
D3  43.95,1.7 180 top
F1  42.43,86.08 270 top
IC1  23.13,13.21 0 top
IC2  46.82,13.03 0 top
IR_RECEIVE  21.7,1.88 0 top
ISP  41.11,72.57 0 top
J1  48.2,57.89 180 bottom
JP1  44.97,25.02 0 top
JP2  19.7,63.12 0 top
JP3  46.62,32.13 90 top
LED1  63.77,55.75 90 top
LED2  60.9,55.85 90 top
LED3  60.57,50.77 0 top
Q1  41.34,5.84 180 top
Q2  48.02,28.32 180 top
R1  42.43,91.44 180 top
R2  42.46,89.41 180 top
R3  56.86,43.64 0 top
R4  43.5,65.74 270 top
R5  61.1,59.66 270 top
R6  13.45,73.15 90 top
R7  54.8,50.75 0 top
R8  54.72,53.42 0 top
R9  54.9,47.52 0 top
R10  49.95,3.18 180 top
R11  58.89,1.63 180 top
R12  33.19,3.4 0 top
R13  1.54,3.81 90 top
R14  63.77,59.82 270 top
R15  45.1,71.25 270 top
R18  11.76,58.87 0 top
R19  16.78,54.99 0 top
R23  35.04,24.64 0 top
R24  33.34,17.83 180 top
S1  56.4,58.29 270 top
S2  57.67,71.12 270 top
SG1  60.36,38 90 top
SONIC  28.28,56.57 0 top
U2  19.16,79.45 180 top
U3  48.68,48.03 270 top
U4  33.06,21.08 0 top
U$1  8.88,11.66 90 top
U$2  8.8,6.73 90 top
U$3  62.73,1.17 180 top
U$4  2.3,1.27 180 top
U$5  48.78,78.11 90 top
U$6  52.59,30.86 180 top
U$7  17.84,12.19 90 top
U$8  17.97,7.52 90 top
U$10  5.35,90.17 270 top
U$13  32.93,1.35 180 top
U$15  55.51,8.15 270 top
U$16  55.28,13.67 270 top
X1  59.75,86.41 180 top
X2  19.49,90.45 0 top
X3  13.45,11.07 270 bottom
X4  4.13,11.13 270 bottom
X5  60.67,10.49 90 bottom

### Tracks (layer width: path | path; a pad name or v marks a point on that pad's centre or on a via)
ACCEL_BYP
  Top 0.254: U4.2 29.22,21.58 C13.1
D+
  Top 0.305: R1.2 41.16,91.44 27.57,77.85 U2.4 | U2.4
D-
  Top 0.305: U2.3 27.92,77.05 40.27,89.41 R2.2
GND  (via drill 0.5, 0.6)
  Top 0.254: U4.12 35.56,21.58 35.57,21.59 v37.35,21.34 | U4.5 v31,19.18
  Top 0.305: U2.35 15.96,72.34 15.63,72.01 15.13,72.01 v15,71.88 14.58,72.3 R6.1 | X1.GND 56.53,88.01 v53.48,91.06 | C6.2 23.9,89.65 v23.38,90.17 | C4.2 15.24,89.65 v15.63,90.17 15.63,88.9 v17.79,86.74 | U2.15 20.76,86.56 v22.62,88.39 | U2.5 23.85,78.78 23.25,79.5 v23.25,81.28 | U2.43 22.36,72.52 v22.62,72.14 | C1.2 32.86,85.55 v33.03,85.6 | C14.2 29.2,24.87 v27.44,23.11 27.44,21.65 C13.2 | IR_RECEIVE.4 23.23,3.4 v23.25,3.68 | IR_RECEIVE.1 19.16,3.33 v18.94,3.56 | U$8.4 15.29,8.17 v15.25,8.13 | U$8.1 18.8,6.36 v19.44,5.97 | U$2.1 10.19,6.08 v11.06,5.21 | U$1.1 9.71,11.01 v9.66,9.91 | U$1.4 8.07,12.39 7.51,12.95 7,12.95 v6.49,12.45 | U$2.4 7.99,7.52 7.63,7.87 6.74,7.87 v6.36,7.49 | U$7.4 17.02,12.84 16.9,13.59 v16.9,13.97 | R12.2 34.66,3.53 v35.45,3.56 | U$16.4 56.85,13.01 v57.8,12.45 | U$16.1 54.4,14.31 v55.64,15.62 | U$15.1 54.33,8.8 v53.48,9.65 | U$15.4 57.28,7.5 v58.43,7.11 | IC2.8 50.37,10.1 v50.69,10.03 | C8.2 22.29,68.12 v22.87,68.2 | R13.2 v2.04,6.22 | U4.10 35.06,20.58 v35.7,19.81 | C16.2 46.09,61.62 v46.11,60.2 | v60.59,50.67 60.79,49.22 LED3.4 LED3.5 LED3.6 62.65,52.47 63.64,53.47 LED1.C 63.54,54.8 LED2.C 61.21,54.74 60.08,54.74 59.45,55.37 S1.2 S1.1 | C3.2 46.85,85 C7.2 C2.2 50.79,84.85 C5.2 51.49,84.8 v52.72,83.57 | IC1.13 22.8,15.04 v22.75,14.99 | C12.2 48.08,73.43 C10.2 48.19,75.22 v48.27,75.95 | C9.2 47.75,51.71 C11.2 47.1,51.54 46.88,51.31 v46.88,50.16 46.11,49.4 46.11,48.51 46.6,48.03 U3.2 | SG1.- 60.5,33.36 v60.46,34.8 | v51.83,35.05 51.62,34.5 U$6.6 U$6.7 U$6.8 | IC1.8 v26.17,10.29 | U$7.1 18.64,11.26 18.55,11.18 18.3,11.18 17.79,10.67 v16.4,10.67 | JP2.9 40.04,65.68 v40.53,66.55
  Top 0.305: IC2.13 46.5,17.28 v45.48,19.3 | Q2.2 46.94,28.39 v46.37,27.81 | C15.2 39.57,21.78 v39.13,21.46 | R11.2 58.04,2.93 58.05,2.79 v58.05,3.3 | U2.23 12.19,83.45 v11.57,84.84 11.32,85.09 U$10.6 v7.38,85.09 U$10.5 | 8.65,80.01 U$10.10 v6.49,80.01 | SONIC.4 27.11,58.34 v27.06,58.29 | R19.2 18.05,55.24 v18.94,55.24
  Top 0.762: Q1.2 39.72,6.94 v39.13,6.98
  Top 1.016: U$5.2 v49.67,78.1
  pour Bottom (rank 2): 0.04,92.84 64.88,92.56 65.16,23.75 65.54,16.89 65.29,9.65 65.29,-0.43 -0.19,-0.25 -0.11,3.94 -0.11,15.24 -0.09,92.79
IR_EDGE_LEFT  (via drill 0.5)
  Top 0.305: U$6.5 52.27,32.58 v52.46,32.13
  Bottom 0.305: v52.46,32.13 52.46,29.59 JP1.2
IR_EDGE_RIGHT
  Top 0.305: U$6.15 54.22,27.08 55,26.42 57.29,26.42 58.05,25.53 JP1.6
IR_SWITCH  (via drill 0.5)
  Top 0.305: Q2.1 48.59,29.78 48.02,30.73 46.24,30.73 45.73,30.35 45.73,28.96 43.57,26.8 43.57,22.35 42.18,20.95 v42.18,20.45 | IC2.3 45.85,9.26 45.48,8.89 43.95,8.89 43.32,9.52 v43.32,14.73
  Bottom 0.305: v42.18,20.45 42.18,16.76 v43.32,14.73
IRSEND
  Top 0.305: D3.A 45.91,2.46
  Top 0.762: 45.91,2.46 46.88,3.17 48.02,3.16 R10.2
LED-A
  Top 0.305: R15.2 45.1,70.36 41.92,67.18 41.92,61.34 JP2.10
LINE_CENTER  (1 unrouted)
  Top 0.305: U$6.13 52.92,24.95
LINE_LEFT  (1 unrouted)
  Top 0.305: 50.43,25.15 52.27,26.98 U$6.12
LINE_RIGHT
  Top 0.305: JP1.5 53.61,26.92 53.61,27.92 U$6.14
MISO  (via drill 0.5)
  Top 0.305: v26.43,85.22 24.96,83.75 U2.11 19.2,83.45 18.94,83.18 v17.92,80.52 | U$10.16 8.27,72.39 8.01,72.26 v7.63,71.63
  Bottom 0.305: ISP.1 40.53,75.18 40.53,79.5 37.99,82.04 29.6,82.04 v26.43,85.22 | v17.92,80.52 14.36,80.39 13.35,79.37 13.09,79.25 11.19,77.22 v7.63,71.63
MOSI  (via drill 0.5)  (2 unrouted)
  Top 0.305: v32.27,65.66 31.89,65.53 31.89,68.07 35.7,71.88 38.62,71.88 39.43,71.3 41.24,71.3 ISP.4 | IC1.14 22.15,21 v26.05,24.89 | U2.10 22.72,82.65 20.71,82.68 20.33,82.3 20.33,79.37 23.13,76.58 23.13,75.56 24.27,74.42 24.27,70.23 v26.94,67.56 | v27.32,62.99 JP2.4 27.32,60.45 24.4,57.53 22.11,58.04 v21.86,57.78 | U$10.13 3.79,73.75 v3.7,73.66 | v3.82,67.18 6.4,67.18 15.89,57.69
  Bottom 0.305: v32.27,65.66 29.86,65.66 29.86,66.17 28.46,67.56 v26.94,67.56 27.32,67.18 v27.32,62.99 | 39.89,26.03 39.26,25.65 26.79,25.65 26.67,25.51 v26.05,24.89 16.65,24.89 15.63,25.91 14.62,46.23 14.62,50.42 12.84,52.07 12.71,56.9 13.6,57.66 v21.86,57.78 | v3.7,73.66 3.7,67.31 v3.82,67.18
  other vias: 15.89,57.66
N$2
  Top 0.305: LED2.A 61.15,58.74 R5.2
N$3
  Top 0.305: X3.P$2 13.5,13.61 15.25,15.11 17.39,15.11 18.55,13.84 18.64,13.75 U$7.3
N$4
  Top 0.305: R2.1 51.7,89.41 55.51,85.6 57.24,85.6 X1.D-
N$5
  Top 0.305: X1.D+ 57.37,86.41 57.42,86.36 55.89,86.36 50.81,91.44 R1.1
N$6
  Top 0.305: R7.2 58.54,50.75 LED3.2
N$7
  Top 0.305: U$2.6 7.99,4.8 7.38,4.32 5.98,4.32 5.22,4.95 X4.P$5
N$8
  Top 0.305: R8.2 56.74,53.42 LED3.1
N$9
  Top 0.305: R9.2 56.51,47.52 LED3.3
N$10
  Top 0.305: X4.P$4 8.4,8.58 U$2.3
N$11
  Top 0.305: U$16.6 56.09,14.42 57.16,15.49 60.46,15.49 X5.P$5
N$12
  Top 0.305: U$1.6 8.14,10.93 8.14,9.65 7.89,9.4 6.24,9.4 4.51,11.12 X4.P$3
N$13  (via drill 0.5)
  Top 0.305: IC2.12 47.15,17.67 v47.38,19.18 45.99,20.57 44.59,20.57 37.86,13.84 32.14,13.84 28.97,17.02 v26.81,17.02 | IC1.12 23.45,17.07 v23.13,17.4 | v20.46,20.07 12.71,20.07 12.33,20.45 1.66,20.45 1.03,21.08 1.03,66.67 v2.17,67.82 | U2.22 15.16,85.3 14.62,85.85 11.03,85.89 10.43,86.36 2.43,86.36 v1.28,85.22
  Bottom 0.305: v26.81,17.02 26.43,17.4 v23.13,17.4 23,17.4 21.98,18.41 21.98,18.54 v20.46,20.07 | v2.17,67.82 2.17,68.07 1.54,68.71 1.54,78.87 2.55,79.88 2.55,83.57 v1.28,85.22
N$14
  Top 0.305: U$16.3 54.48,12.08 55.13,11.43 58.56,11.43 X5.P$4
N$15
  Top 0.305: U$15.6 56.32,9.32 57.42,10.41 60.46,10.41 X5.P$3
N$16
  Top 0.305: U$15.3 54.71,7.15 56.15,6.22 58.94,6.22 X5.P$2
N$17
  Top 0.305: IC1.9 28.95,16.13 31.89,13.08 37.99,13.08 42.3,16.51 42.3,17.4 42.94,18.03 44.72,18.03 45.85,16.9 IC2.14
N$18
  Top 0.762: Q1.3 41.59,3.78 D3.C
N$19
  Top 0.305: LED1.A 63.64,58.59 R14.2
N$20  (via drill 0.5)
  other vias: 44.46,67.95
N$21
  Top 0.305: X4.P$2 8.32,13.66 U$1.3
N$24  (via drill 0.5)
  other vias: 35.06,58.04
N$29
  Top 0.305: U2.42 21.56,72.68 21.55,71.17 C8.1
N$30
  Top 0.305: U$8.6 15.72,5.47 13.97,5.47 X3.P$5
N$31
  Top 0.305: U$8.3 18.26,8.67 17.92,9.02 13.93,9.02 X3.P$4
N$32
  Top 0.305: U$7.6 14.17,11.54 X3.P$3
N$38
  cutout Bottom: 16.4,53.21 39,53.09 39.13,26.29 16.4,26.29
N$41
  Top 0.305: JP1.1 45.35,25.95 Q2.3
N$42
  Top 0.305: R3.2 59.21,43.64 SG1.+
PB0  (via drill 0.5)
  Top 0.305: U2.8 26.96,81.05 27.19,81.28 v27.34,81.69 | v37.6,70.74 37.63,68.99 37.63,60.86 JP2.8
  Bottom 0.305: v27.34,81.69 28.44,80.54 28.97,80.52 37.35,80.52 38.75,79.12 38.75,77.72 37.6,76.58 v37.6,70.74
PB4
  Top 0.305: U$10.15 7.12,72.39 8.52,73.66 10.55,73.66 11.06,74.17 11.06,78.36 12.08,79.37 13.29,79.37 U2.28
PB5  (via drill 0.5)
  Top 0.305: JP3.1 45.1,32.89 45.1,38.23 47,40.26 47.13,40.39 47.13,41.27 45.35,43.05 42.94,45.34 42.81,53.34 39.64,56.26 29.22,56.26 29.1,56.13 28.08,55.37 21.22,55.37 20.33,56.26 13.35,63.37 13.35,65.53 v11.57,67.31 | U2.29 12.5,78.65 12.08,78.23 12.08,72.39 v11.32,71.63
  Bottom 0.305: v11.57,67.31 10.55,67.31 10.05,66.8 9.54,66.8 8.39,67.94 8.39,68.71 v11.32,71.63
PB6  (via drill 0.5)
  Top 0.305: U2.30 14.24,77.85 15,78.61 15.63,78.61 16.9,77.34 v18.55,77.34 | v23.25,69.85 26.05,67.06 26.05,66.55 28.64,64.08 28.64,60.91 30.11,59.44 31.18,58.34 | R18.2 R19.1 14.53,55.03 v14.36,53.97 | SONIC.2 31.18,58.34 | 31.18,58.34 v31,58.17
  Bottom 0.305: v18.55,77.34 18.55,76.33 21.6,73.41 21.6,71.63 v23.25,69.85 | v14.36,53.97 20.08,53.97 22.87,56.13 23.25,56.51 25.03,56.51 25.54,57.02 27.32,57.02 28.46,58.17 v31,58.17
PB7  (via drill 0.5)
  Top 0.305: v38.75,86.36 43.57,86.36 44.21,86.87 51.96,86.87 55.13,83.69 58.69,83.69 60.59,81.79 60.59,80.9 61.23,80.26 61.86,80.26 64.27,77.85 64.27,64.52 62.37,62.36 v62.37,55.88 | v32.4,88.9 26.81,88.9 25.8,87.89 25.8,87.88 U2.12 | R3.1 55.5,43.7 v54.5,44.96
  Bottom 0.305: v38.75,86.36 34.81,86.36 v32.4,88.9 | v62.37,55.88 62.37,54.74 61.1,53.21 55.26,53.21 54.5,52.45 v54.5,44.96
PC6  (via drill 0.5)
  Top 0.305: U2.31 15.34,77.05 v15.63,77.34 | SONIC.3 20.66,54.79 12.2,63.37 v9.66,68.07
  Bottom 0.305: v15.63,77.34 18.55,74.42 18.55,69.98 11.7,70.1 v9.66,68.07
PC7  (via drill 0.5)
  Top 0.305: R14.1 v63.77,61.98 | U2.32 20.38,76.25 v20.71,76.58 | v29.98,68.58 35.45,73.84 43.07,73.84 v45.48,73.79 | v53.61,67.31 55.51,65.4 v62.75,65.4
  Bottom 0.305: v20.71,76.58 v29.98,68.58 | v63.77,61.98 63.64,64.52 v62.75,65.4 | v45.48,73.79 49.67,71.37 v53.61,67.31
PD0  (via drill 0.5)
  Top 0.254: U4.4 30.5,20.58 v30.11,20.19
  Top 0.305: R23.2 37.22,24.64 v38.75,24.13 | U2.18 18.36,83.76 v17.79,83.18 | U$10.3 2.93,87.63 v3.44,88.77
  Bottom 0.305: v30.11,20.19 30.11,22.61 31.76,24.13 v38.75,24.13 40.53,24.13 41.16,24.76 41.16,41.78 42.43,43.56 42.43,58.93 42.3,58.93 39.89,61.34 39.89,63.63 39.76,63.75 34.68,68.45 18.43,83.18 v17.79,83.18 17.41,82.68 7.51,82.68 5.6,84.58 5.6,86.61 v3.44,88.77
PD1  (via drill 0.5)  (1 unrouted)
  Top 0.254: U4.6 32.43,17.89
  Top 0.305: 32.43,17.89 R24.2 | 32.52,17.78 v31,17.53 | U2.19 17.56,84.23 v16.4,83.57 | U$10.1 2.3,90.17 v1.92,90.55
  Bottom 0.305: v31,17.53 32.02,18.29 32.02,21.08 33.79,22.86 40.4,22.86 41.8,24.26 41.8,41.66 43.95,44.2 43.95,58.42 40.53,61.85 40.53,64.01 18.17,84.45 17.28,84.45 v16.4,83.57 10.43,83.57 7.51,86.49 7,86.61 2.93,90.68 2.04,90.68 v1.92,90.55
PD4  (via drill 0.5)
  Top 0.305: U2.25 11.76,81.85 v11.7,81.53 | JP2.6 34.05,61.34 v36.46,63.75
  Bottom 0.305: v11.7,81.53 11.95,81.91 18.81,81.91 34.43,67.82 34.94,66.93 37.1,64.77 37.1,64.39 v36.46,63.75
PD6  (via drill 0.5)
  Top 0.305: U2.26 14.47,81.05 v16.78,78.87 | JP2.7 33.79,64.9 v33.67,64.77
  Bottom 0.305: v33.67,64.77 33.67,66.29 32.4,67.56 32.4,68.71 31.89,69.21 20.59,79.12 v16.78,78.87
PD7  (via drill 0.5)
  Top 0.305: U2.27 11.58,80.25 10.43,81.41 1.79,81.41 1.54,81.03 v1.54,80.52 | Q1.1 42.29,7.63 40.02,9.91 34.43,9.91 33.16,8.64 v29.6,6.98
  Bottom 0.305: v1.54,80.52 0.77,79.76 0.9,36.96 1.03,36.83 1.03,8.13 0.9,8 0.9,4.7 2.93,2.54 25.41,2.54 26.56,3.68 26.56,7.11 27.32,7.87 28.33,7.87 29.22,6.98 v29.6,6.98
PE2
  Top 0.305: R6.2 13.32,74.32 13.35,74.8 13.35,75.43 U2.33
PE6  (via drill 0.5)
  Top 0.305: IR_RECEIVE.3 21.7,4.8 22.24,5.33 36.08,5.33 39.51,1.9 40.53,1.9 41.03,2.41 41.03,3.05 37.35,6.98 37.35,8 38.11,8.76 v39.51,8.76 | U2.1 29.34,75.45 v29.35,75.44 | v40.02,19.43 40.02,20.83 42.3,23.11 42.3,27.43 43.83,28.96 43.83,39.62 44.97,40.77 44.97,42.04 44.84,42.16 v43.83,42.29
  Bottom 0.305: v40.02,19.43 40.02,10.79 39.51,10.03 v39.51,8.76 | v43.83,42.29 43.83,42.93 44.59,43.69 44.72,58.8 41.16,62.36 41.16,64.26 39.64,65.79 v29.35,75.44
PF0  (via drill 0.5)  (1 unrouted)
  Top 0.305: U2.41 20.84,72.52 20.89,72.47 20.89,71.17 16.78,67.06 v16.78,65.79 16.78,65.75 | U$6.9 50.32,30.09 48.4,32.13 48.4,35.94 48.65,37.46 48.65,41.78 44.21,46.23 44.21,54.23 40.91,57.4 40.4,57.91 v38.62,57.91
  Bottom 0.305: v38.62,57.91 37.1,59.31 25.67,59.31 25.67,58.93 25.29,58.55 23.76,58.55 23.38,58.93 21.35,60.71 20.59,61.47 19.19,62.74 16.78,65.15 16.78,65.75
PF1  (via drill 0.5)
  Top 0.305: U$6.10 50.97,30.45 49.03,32.51 49.03,35.69 49.29,37.08 49.29,42.04 44.84,46.48 44.84,54.61 41.16,58.17 40.65,58.67 39.38,58.67 38.75,59.31 v38.75,60.83 | U2.40 19.96,71.64 v19.95,71.63
  Bottom 0.305: v19.95,71.63 20.08,71.5 20.08,67.31 22.75,60.83 v38.75,60.83
PF4  (via drill 0.5)
  Top 0.305: U2.39 19.19,72.77 19.04,72.62 19.04,70.84 16.65,68.58 14.87,66.8 14.87,64.13 19.32,59.69 v24.4,59.69 | U$6.11 51.62,30.82 49.67,32.77 49.67,35.31 49.92,36.83 49.92,42.29 45.48,46.74 45.48,54.86 41.41,58.8 40.53,59.69 v39.89,59.69
  Bottom 0.305: v39.89,59.69 37.86,59.69 37.6,59.94 25.03,59.94 v24.4,59.69
PF5  (via drill 0.5)
  Top 0.305: U2.38 18.36,71.56 14.11,67.31 14.11,63.75 21.73,56.13 27.57,56.13 28.33,56.9 40.14,56.9 43.57,53.85 43.57,45.85 46.49,42.93 47.89,41.66 48.02,39.5 48.02,38.99 v47.76,38.86 | U$6.3 53.57,37.25 v53.61,38.1
  Bottom 0.305: v53.61,38.1 48.4,38.1 v47.76,38.86
PF6
  Top 0.305: U2.37 17.56,71.91 15.63,69.98 2.81,69.98 1.54,71.25 1.54,75.72 2.52,77.47 U$10.11
PF7
  Top 0.305: U2.36 16.76,72.12 15.25,70.61 3.19,70.61 2.17,71.63 2.17,75.56 2.55,76.07 4.87,76.07 6.24,77.47 U$10.12
PHOTO_LEFT  (via drill 0.5)
  Top 0.305: U$3.2 62,1.63 R11.1 60.36,1.63 62.75,4.44 v64.02,4.44 | U$6.1 54.87,33.79 54.88,33.78 55.26,33.78 v56.15,32.89
  Bottom 0.305: v64.02,4.44 63.64,4.83 63.64,16.64 61.99,18.29 61.99,21.72 63.13,23.49 63.13,28.19 60.46,30.73 58.18,30.73 v56.15,32.89
PHOTO_MID  (via drill 0.5)
  Top 0.305: U$13.2 32.28,3.2 R12.1 32.34,3.75 v31,2.67 | U$6.2 54.22,33.05 54.5,32.77 v55.89,31.5
  Bottom 0.305: v31,2.67 37.73,2.67 39.76,1.65 60.85,1.52 63,3.81 63,16.26 61.35,17.78 61.35,22.48 62.37,23.75 62.37,27.81 60.85,29.34 58.05,29.34 v55.89,31.5
PHOTO_RIGHT  (via drill 0.5)
  Top 0.305: U$4.2 1.54,1.64 R13.1 17.58,3.72 18.3,4.44 20.33,4.44 21.86,5.97 36.84,5.97 v40.02,2.79 | U$6.4 52.92,32.95 v55.89,30.1
  Bottom 0.305: v40.02,2.79 40.02,2.29 60.21,2.16 62.37,4.32 62.37,15.87 60.72,17.53 60.72,22.73 61.73,24 61.73,27.3 60.34,28.7 57.42,28.7 v55.89,30.1
RGB_B  (via drill 0.5)
  Top 0.305: R9.1 54.22,47.78 54.24,47.88 54.62,48.89 v56.53,48.89 | IC2.2 45.2,11.02 47.13,12.83 49.8,12.83 51.7,14.73 53.35,14.73 57.16,18.54 60.21,18.54 63,21.34 63,25.91 60.46,28.45 58.94,28.45 58.43,28.96 58.43,34.8 59.58,35.94 61.61,35.94 v62.75,37.08
  Bottom 0.305: v62.75,37.08 63.51,37.97 63.51,46.74 61.35,48.89 v56.53,48.89
RGB_G  (via drill 0.5)
  Top 0.305: v57.04,45.97 53.61,45.97 52.97,46.48 52.97,53.09 53.18,53.42 R8.1 | v61.48,37.08 59.83,37.08 57.8,35.18 57.8,28.7 58.94,27.69 59.32,27.69 62.24,25.15 62.24,21.72 59.83,19.3 56.91,19.3 53.1,15.49 51.45,15.49 49.29,13.46 46.75,13.46 44.59,11.43 44.59,10.15 IC2.1
  Bottom 0.305: v61.48,37.08 62.88,38.48 62.88,45.97 v57.04,45.97
RGB_R  (via drill 0.5)
  Top 0.305: R7.1 53.78,51.64 54.37,52.2 v56.65,52.2 | v57.8,17.53 61.73,17.53 v62.88,18.67 | IC2.15 45.2,16.53 44.59,17.14 v43.57,17.14
  Bottom 0.305: v43.57,17.14 44.59,18.29 57.04,18.29 v57.8,17.53 | v56.65,52.2 62.12,52.2 64.15,49.91 64.15,19.94 v62.88,18.67
RST  (via drill 0.5)  (6 unrouted)
  Top 0.305: U2.13 22.36,86.49 v24.4,88.01 | 49,65.06 50.56,62.86 v50.56,62.36 | S1.4 S1.3 53.73,60.83 v53.35,61.21 | C16.1 45.83,65.03 45.86,65.06 | R4.1 43.5,67 43.87,67.39 44.41,67.92
  Bottom 0.305: v24.4,88.01 26.81,88.01 27.83,86.99 30.37,84.58 39,84.58 44.34,77.98 44.21,68.2 | 44.21,68.2 45.89,65.82 45.89,65.91 45.86,65.06 49,65.06 | v50.56,62.36 52.08,62.36 v53.35,61.21 | 39.89,70.1 39.89,69.98 41.67,68.2 44.21,68.2
  other vias: 49.03,65.02 45.86,65.02
RX
  Top 0.305: U2.20 16.76,86.37 14.74,88.39 10.08,88.39 U$10.4
SCK  (via drill 0.5)  (2 unrouted)
  Top 0.305: U2.9 25.79,81.91 26.17,81.91 26.68,82.55 v26.68,83.69 27.32,83.69 28.97,85.34 28.97,86.99 29.98,88.01 33.03,88.01 33.92,88.9 33.92,89.66 31.38,92.2 1.54,92.2 0.77,91.44 0.77,87.63 v1.28,87.12 | ISP.3 35.24,72.57 31.76,69.09 31.15,68.45 31.13,67.94 31.13,66.67 JP2.5 29.86,61.09 31,59.94 34.43,59.94 35.06,58.04 | IC1.11 24.1,18.33 25.03,19.18 25.79,19.18 | IC2.11 47.8,16.67 49.16,18.03 49.16,19.3 48.15,21.46 47.29,21.55 46.11,21.59 43.83,21.59 43.32,21.08 43.32,20.19 40.78,17.65 32.4,14.48 28.14,18.87 27.95,19.05 27.83,19.18 25.79,19.18 | v25.73,20.13 25.73,19.24 25.79,19.18 | U$10.14 8.14,74.93 v7.38,75.69
  Bottom 0.305: ISP.3 39.71,72.72 38.24,74.17 38.24,76.33 39.51,77.47 39.51,79.37 39.26,79.63 38.49,80.52 37.73,81.28 29.22,81.28 v26.68,83.69 | v25.73,20.13 25.73,22.8 28.08,25.02 40.14,25.02 40.53,25.4 40.53,54.23 39.64,55.12 37.99,55.12 35.06,58.04 | v1.28,87.12 1.28,86.74 3.82,84.2 3.82,76.58 5.35,75.06 6.74,75.06 v7.38,75.69 | 25.67,20.07 25.67,20.57
STEP_1_1  (via drill 0.5)
  Top 0.305: U$1.5 7.79,11.66 7.76,11.68 7.38,11.68 7,11.43 v7,10.41 | IC1.3 22.15,9.69 20.71,8.13 20.08,8.13 19.06,9.14 v19.06,9.65
  Bottom 0.305: v7,10.41 8.39,8.89 11.82,8.89 12.71,9.78 17.54,9.78 17.67,9.65 v19.06,9.65
STEP_1_2
  Top 0.305: U$1.2 10.83,11.66 12.71,9.78 17.92,9.78 18.68,10.54 19.44,10.54 19.82,11.3 20.71,11.3 21.5,11.33 IC1.2
STEP_1_3  (via drill 0.5)
  Top 0.305: U$2.5 7.12,6.73 6.62,6.22 v6.62,5.33 | IC1.1 20.85,9.66 v20.46,9.14
  Bottom 0.305: v6.62,5.33 8.14,3.68 17.54,3.68 18.3,4.44 18.3,6.22 20.46,8.38 v20.46,9.14
STEP_1_4  (via drill 0.5)
  Top 0.305: U$2.2 10.43,6.73 11.06,7.37 v11.06,9.91 | IC1.15 21.5,17.12 20.97,17.65 v11.06,17.65
  Bottom 0.305: v11.06,9.91 v11.06,17.65
STEP_2_1  (via drill 0.5)
  Top 0.305: U$7.5 16.14,12.19 v15.76,12.45 | IC1.7 24.75,11.71 v24.65,11.81
  Bottom 0.305: v15.76,12.45 16.14,12.19 22.75,12.19 23.51,11.43 24.27,11.43 v24.65,11.81
STEP_2_2
  Top 0.305: U$7.2 22.87,12.19 24.1,10.96 IC1.6
STEP_2_3  (via drill 0.5)
  Top 0.305: U$8.5 16.04,7.52 v15.38,6.73 | IC1.5 23.45,8.58 19.95,5.08 16.9,5.08 v16.78,5.21
  Bottom 0.305: v15.38,6.73 15.38,6.6 v16.78,5.21
STEP_2_4
  Top 0.305: U$8.2 21.12,7.52 22.8,9.2 IC1.4
STEP_3_1  (via drill 0.5)
  Top 0.305: IC2.7 48.45,9.35 48.78,9.02 51.83,9.02 v52.21,9.4 | U$15.5 57.82,8.15 v58.31,8.64
  Bottom 0.305: v52.21,9.4 52.34,8.64 52.84,8.13 57.8,8.13 v58.31,8.64
STEP_3_2
  Top 0.305: U$15.2 48.63,8.15 47.8,8.98 IC2.6
STEP_3_3  (via drill 0.5)
  Top 0.305: IC2.5 47.15,10.94 47.76,11.56 51.32,11.56 v52.21,12.57 | U$16.5 57.24,13.66 v57.92,14.35
  Bottom 0.305: v52.21,12.57 56.15,12.57 v57.92,14.35
STEP_3_4
  Top 0.305: U$16.2 51.65,13.66 50.18,12.19 47.38,12.19 46.49,11.3 IC2.4
TX  (via drill 0.5)
  Top 0.305: U2.21 15.96,86.16 14.36,87.76 11.95,87.76 v11.44,86.87 | U$10.2 v11.57,90.17
  Bottom 0.305: v11.44,86.87 v11.57,90.17
UCAP
  Top 0.305: U2.6 28.19,79.45 31.38,82.55 31.46,82.63 C1.1
V_BATT
  Top 1.016: S2.1 57.78,73.13 55.13,73.15 53.23,70.87 49.29,70.87 47.38,68.96 47.38,59.41 J1.2
V_BATT_POWER  (via drill 0.5, 0.6)
  Top 0.305: 13.4,16.2 X3.P$1 | R18.1 11.23,53.17 15.63,48.64 15.63,23.62 v13.47,21.34
  Top 0.406: 8.14,16.71 7.63,16.2
  Top 0.762: X4.P$1 7.63,16.2 13.4,16.2 | 12.97,16.64 X3.P$1 13.47,16.13 17.79,16.13 20.84,13.08 29.73,13.08 31.76,11.05 40.27,11.05 47,4.57 50.94,4.57 | D2.P$2 51.97,42.78 v56.02,38.86 62.5,38.86 64.02,37.85 64.02,7.49 61.61,5.46 61.23,5.46 X5.P$1 59.83,4.57 50.94,4.57 | R10.1 50.8,4.43 50.94,4.57 | v11.82,19.18 9.03,19.18 8.14,18.16 8.14,16.71
  Top 1.016: S2.2 58.92,70.46 57.54,69.09 53.52,69.09 D2.P$2
  Bottom 0.305: v13.47,21.34 13.47,20.83 v11.82,19.18
  Bottom 0.762: v56.02,38.86 53.86,36.7 49.67,36.7 47.38,34.42 JP3.2
V_USB
  Top 0.305: D1.P$2 40,83.68 F1.2
VBUS  (via drill 0.5)
  Top 0.305: X1.VBUS 55.16,84.81 52.34,87.63 41.95,87.63 F1.1 39.91,87.35 v39.89,87.38 | U2.7 27.94,80.25 29.98,82.3 29.98,86.61 30.49,87.25 v35.45,87.25
  Bottom 0.305: v35.45,87.25 v39.89,87.38
VCC  (via drill 0.5, 0.6)  (4 unrouted)
  Top 0.254: 24.78,16.1 IC1.10
  Top 0.305: ISP.2 43.14,75.11 46.24,75.06 47,74.17 47,73.02 46.24,72.14 46.24,72.1 R15.1 46.28,72.1 46.49,71.88 46.49,69.72 45.73,68.96 45.73,66.42 44.72,65.4 | 43.84,81.67 41.8,81.66 41.77,81.66 D1.P$1 | U2.14 21.6,85.21 21.6,84.07 24.02,84.07 24.78,84.84 v24.78,85.22 | 3.06,1.65 v4.58,1.27 | IR_RECEIVE.2 20.43,3.15 v20.46,3.56 | 38.87,77.09 38.75,77.22 | C5.1 50.84,81.89 50.94,81.79 | C2.1 48.91,81.91 49.03,81.79 | C7.1 47,81.79 | C3.1 45.17,83.24 45.35,83.06 45.35,81.91 45.22,81.79 | IC1.16 20.85,15.36 20.84,14.48 21.35,13.97 24.02,13.97 | 24.02,13.97 30.11,13.97 31.89,12.19 v32.27,12.19 37.99,12.19 42.68,16 43.61,16 IC2.16 44.55,15.15 44.84,14.35 48.15,14.35 48.45,15.16 IC2.10 48.45,15.06 48.78,14.73 49.42,14.73 58.05,23.49 58.91,23.49 59.32,23.53 JP1.7 60.21,25.78 58.79,27.07 57.04,27.07 | 24.78,16.1 24.78,14.73 24.02,13.97 | U3.3 47.35,47.08 | 47.35,47.08 48.4,47.12 | 48.4,47.12 48.4,49.78 v48.53,49.91 48.15,49.91 47.76,49.53 47.76,48.89 47.21,48.89 U3.1 | 47.35,47.08 47.29,45.94 49.16,43.94 49.03,44.07 50.94,42.29 51.19,42.29 57.16,36.32 57.16,27.2 57.04,27.07 | 57.04,27.07 56.89,27.07 55.87,27.96 U$6.16 | R5.1 61.35,60.58 59.45,62.23 57.67,62.23 56.78,60.83 56.78,54.86 56.27,54.36 53.99,54.36 53.35,55.12 v53.35,55.24 | U2.34 15.16,74.97 15.51,75.31 21.73,75.31 | U$3.1 63.38,2.53 v63.39,2.79 | U$13.1 35.62,1.35 v35.7,1.27 | v32.27,9.78 30.75,9.78 v27.83,6.86 | 14.34,82.65 U2.24 12.23,82.65 12.08,82.8 8.43,82.8 8.93,82.68 | 14.34,82.65 15.13,83.18 15.13,83.57 14.11,84.58 v13.47,84.84 | U2.2 28.39,76.25 29.73,77.6 v31.25,77.6 | 35.19,76.96 34.94,77.22 | 21.73,75.31 21.73,76.83 20.21,78.36 18.76,78.36 14.34,82.65
  Top 0.305: U2.44 23.16,74.51 22.24,75.31 21.73,75.31 | v50.69,50.16 50.81,50.29 v50.81,55.24 46.88,55.24 44.72,57.4 44.72,65.4 | 8.93,82.68 U$10.8 | 44.72,65.4 44.63,64.39 R4.2 | SONIC.1 39.71,54.79 41.54,52.96 41.54,42.42 v43.07,40.89 | 48.4,47.12 48.4,46.23 v48.53,46.1 | v24.65,4.06 24.65,1.27 | U$10.7 8.81,82.55 8.93,82.68
  Top 0.762: 43.59,77.61 43.46,77.61 | 41.08,77.14 42.67,77.08
  Top 1.016: 42.67,77.08 43.07,77.6 43.46,77.61 | 41.08,77.14 ISP.2 41.03,77.22 38.75,77.22 34.94,77.22 32.91,77.22 v31.25,78.87 | U$5.3 52.01,80.34 51.96,81.79 50.94,81.79 49.03,81.79 47,81.79 45.22,81.79 43.95,81.79 43.84,81.67 43.59,81.42 43.59,77.61 | v31.25,78.87 v32.78,78.87 v32.78,77.6 v31.25,77.6 v31.25,78.87
  Bottom 0.305: v32.27,9.78 v32.27,12.19 | 36.08,1.27 36.59,0.89 61.48,0.89 v63.39,2.79 | v50.81,55.24 v53.35,55.24 | v27.83,6.86 27.83,1.4 | 12.59,88.14 12.59,85.47 v13.47,84.84 | v50.69,50.16 48.78,50.16 v48.53,49.91 | v43.07,40.89 43.7,40.89 47,44.2 47,44.96 v48.53,46.1 | 23.13,83.82 23.13,83.57 v24.78,85.22 | v20.46,3.56 21.48,3.56 22.87,5.08 23.76,5.08 v24.65,4.06
  Bottom 0.762: v4.58,1.27 v35.7,1.27 36.08,1.27
  Bottom 1.016: 12.59,88.14 20.84,88.14 23.13,85.85 23.13,83.82 28.08,78.87 v31.25,78.87 v32.78,78.87
  other vias: 24.65,1.52
VCC_3V3  (via drill 0.5)  (1 unrouted)
  Top 0.254: U4.7 33.06,19.02 33.92,18.16 | U4.14 33.56,24.13 | U4.1 31.78,22.2 31,22.99
  Top 0.305: U4.9 34.29,20.08 34.29,18.94 35.06,18.16 | 33.92,18.16 34.81,18.16 | 34.81,18.16 35.06,18.16 | R24.1 34.7,18.05 34.81,18.16 | 33.56,24.13 33.64,24.2 | 33.64,24.2 R23.1 31.37,24.64 C14.1 31,24.47 31,22.99 | 33.64,24.2 34.44,23.39 34.44,23.37 37.73,23.37 37.73,22.99 | 36.59,18.16 35.06,18.16 | 36.59,18.16 38.24,20.07 38.24,20.32 | 38.24,20.32 38.24,22.59 C15.1 | U4.11 35.57,21.08 36.97,20.32 38.24,20.32 | U3.5 49.6,49.09 | C9.1 49.55,53.2 | C9.1 49.55,51.61 C11.1 49.63,49.33 U3.5 | U3.5 49.38,48.98 | U3.5 50.47,48.98 51.07,48.39 51.07,44.83 v50.56,44.45 | 2.81,80.01 U$10.9 2.93,80.01 0.9,77.98 0.9,70.99 2.93,68.96 12.84,68.96 v13.35,68.45 | 36.59,18.16 40.27,18.16 41.03,18.92 41.03,20.83 42.94,22.73 42.94,27.05 44.46,28.57 44.46,39.24 v46.11,40.89 | v18.3,66.8 20.33,66.8 21.48,65.53 JP2.3 v24.78,62.74 | C9.1 49.55,54.22 49.29,54.48 46.75,54.48 41.16,60.07 41.16,60.45 v38.75,62.86
  Bottom 0.305: v50.56,44.45 49.16,43.94 v46.11,40.89 | v13.35,68.45 16.65,68.45 v18.3,66.8 | v38.75,62.86 37.73,62.86 36.72,61.85 25.67,61.85 v24.78,62.74
VREGS_IN
  Top 0.305: C10.1 50.24,73.98 | C10.1 50.11,72.54 C12.1 | C10.1 51.15,74.04 D2.P$1
  Top 1.016: U$5.1 52.35,75.29 D2.P$1
XTAL1
  Top 0.305: C4.1 16.59,91.35 X2.P$2 19.16,88.78 U2.17
XTAL2
  Top 0.305: C6.1 22.4,91.35 X2.P$1 21.49,89.17 19.95,87.63 19.95,85.26 U2.16

### Text on the board
Bottom: Rev10
tPlace: SDA | TX | Mini-USB | SCL | RX | ATMEGA32U4 | GND | GND | CPU | VCC | VCC | 3V3 | GND | CSN | CE | MOSI | SCK | ON | IRQ | MISO | 128x64 / DISPLAY | NRF24L01 | In-System / Programmer / (ISP) | OFF | GND | 5v | RESET | + | - | G | R | B | RGB / LED | Buzzer | Rev10 | Z | X | Y | ACCELEROMETER | Left Wheel | Arms | Right Wheel | LIGHT / CENTER | IR Receive | IR SEND | LIGHT / RIGHT | LIGHT / LEFT | C:/Program Files (x86)/EAGLE-6.3.0/Sparki Logo BW.bmp